# EAGLE design Thermostat (EAGLE 6.0)
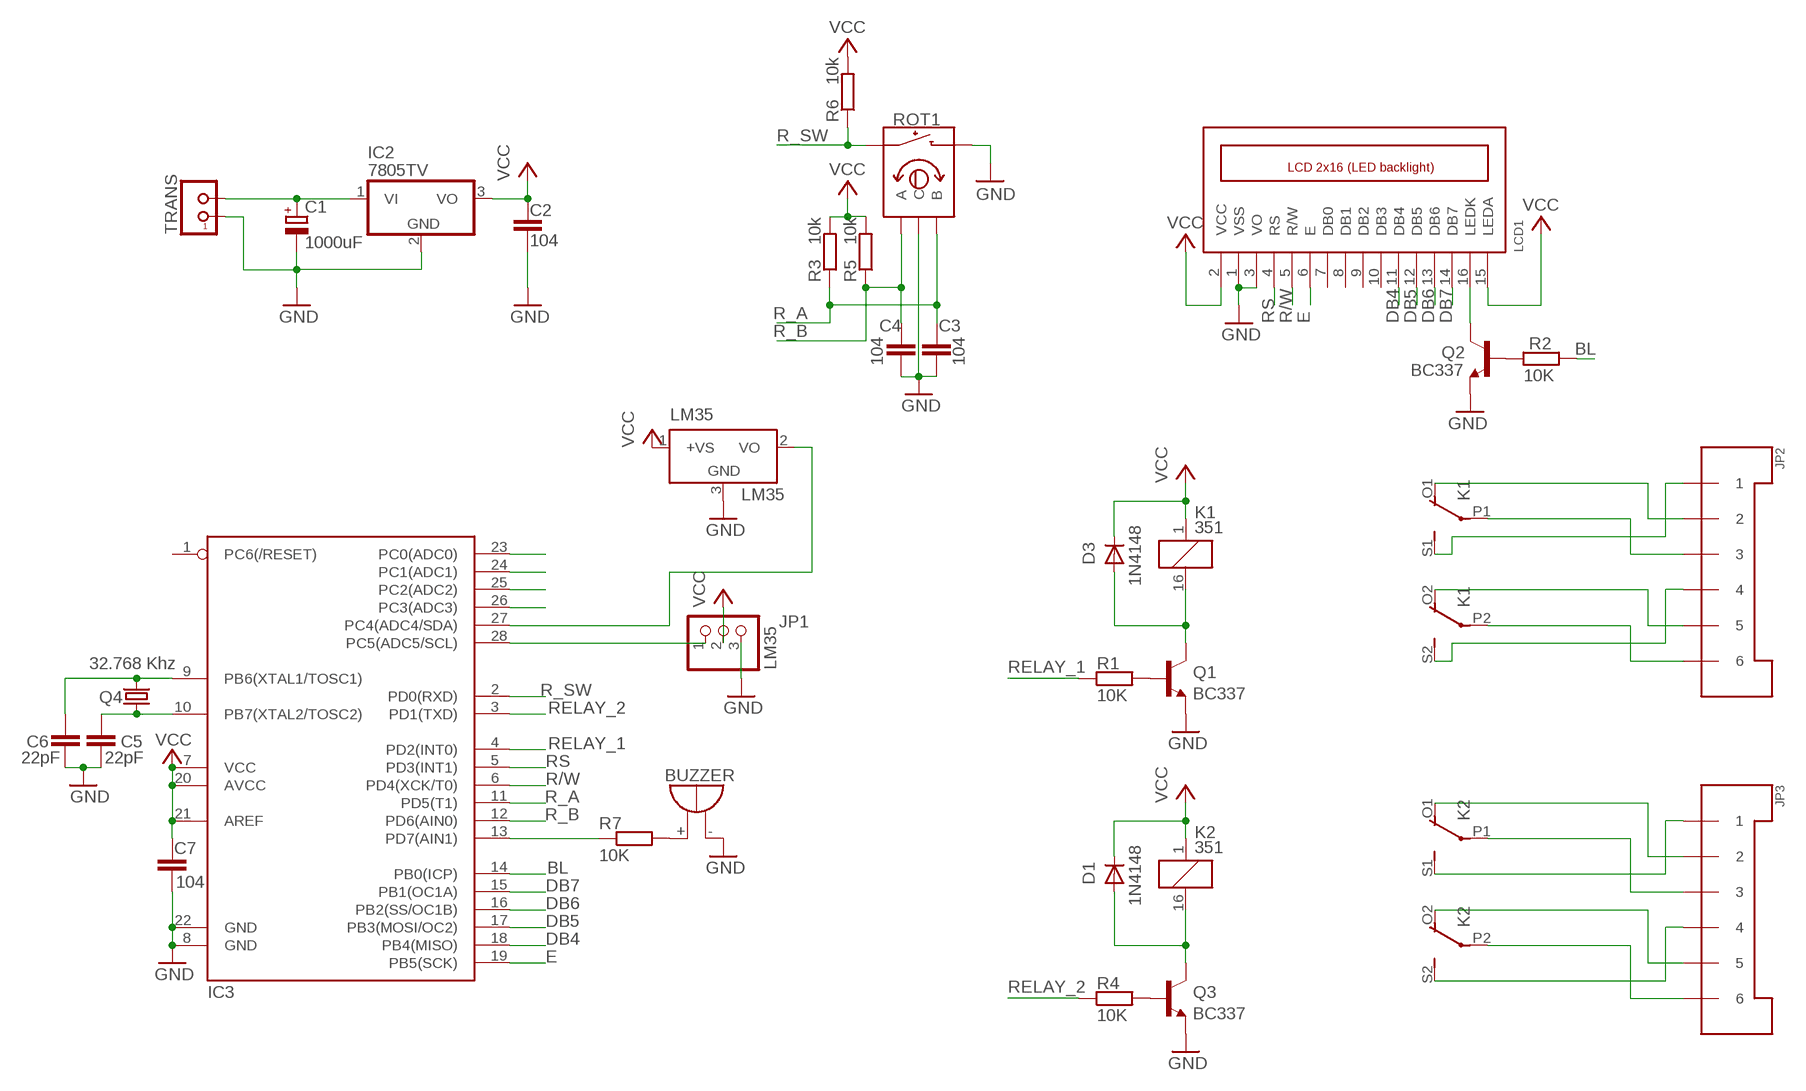
[diagram p0: schematic, sheet 1]

## Parts
BUZZER  F/HMB  [F/HMB]
C1  1000uF  C-POL13-SIDE  [C-TT2D13-SIDE]
C2  104  CC-22X6(FAKI)  [C-22X6(FAKI)]
C3  104  CC-22X6(FAKI)  [C-22X6(FAKI)]
C4  104  CC-22X6(FAKI)  [C-22X6(FAKI)]
C5  22pF  CC-22X6(FAKI)  [C-22X6(FAKI)]
C6  22pF  CC-22X6(FAKI)  [C-22X6(FAKI)]
C7  104  CC-22X6(FAKI)  [C-22X6(FAKI)]
D1  1N4148  1N4148DO35-10  [DO35-10]
D3  1N4148  1N4148DO35-10  [DO35-10]
IC2  7805TV  [TO220V]
IC3  ATMEGA-8-P  [DIL28-3]
JP1  LM35  PINHD-1X3  [1X03]
JP2  KLEMES_DELMAC_6  [KLEMES_DELMAC_6]
JP3  KLEMES_DELMAC_6  [KLEMES_DELMAC_6]
K1  351  [351]
K2  351  [351]
LCD1  LCD-HD44780PINHEAD  [HD44780-2X16-PINHEAD]
LM35  LM35  LM35T0-92  [TO-92]
Q1  BC337  BC548  [TO92-EBC]
Q2  BC337  BC548  [TO92-EBC]
Q3  BC337  BC548  [TO92-EBC]
Q4  32.768 Khz  CRYSTALTC38  [TC38]
R1  10K  R0207/10  [R0270/10]
R2  10K  R0207/10  [R0270/10]
R3  10k  R0207/10  [R0270/10]
R4  10K  R0207/10  [R0270/10]
R5  10k  R0207/10  [R0270/10]
R6  10k  R0207/10  [R0270/10]
R7  10K  R0207/10  [R0270/10]
ROT1  ROTARY/5-PIN  [5-PIN/RP]
TRANS  KLEMESX2  [KLEMESX2]

## Nets
BL: IC3.14(PB0(ICP)) R2.2
DB4: IC3.18(PB4(MISO)) LCD1.11(DB4)
DB5: IC3.17(PB3(MOSI/OC2)) LCD1.12(DB5)
DB6: IC3.16(PB2(SS/OC1B)) LCD1.13(DB6)
DB7: IC3.15(PB1(OC1A)) LCD1.14(DB7)
E: IC3.19(PB5(SCK)) LCD1.6(E)
GND: BUZZER.- C1.- C2.2 C3.2 C4.2 C5.2 C6.2 C7.2 IC2.2(GND) IC3.8(GND) IC3.22(GND) JP1.3 LCD1.1(VSS) LCD1.3(VO) LM35.3(GND1) Q1.E Q2.E Q3.E ROT1.C ROT1.SW2 TRANS.1
N$1: JP2.P$3 K1.P1(2:P)
N$2: JP3.P$2 K2.O1(2:O)
N$3: C1.+ IC2.1(VI) TRANS.2
N$4: D1.A K2.16 Q3.C
N$5: C5.1 IC3.10(PB7(XTAL2/TOSC2)) Q4.1
N$6: Q3.B R4.2
N$7: JP3.P$6 K2.P2(3:P)
N$8: BUZZER.+ R7.2
N$9: IC3.23(PC0(ADC0))
N$10: IC3.13(PD7(AIN1)) R7.1
N$12: IC3.28(PC5(ADC5/SCL)) JP1.1
N$13: LCD1.16(LEDK) Q2.C
N$16: C6.1 IC3.9(PB6(XTAL1/TOSC1)) Q4.2
N$17: Q2.B R2.1
N$22: D3.A K1.16 Q1.C
N$23: Q1.B R1.2
N$25: JP2.P$6 K1.P2(3:P)
N$26: JP2.P$1 K1.S1(2:S)
N$27: JP2.P$5 K1.O2(3:O)
N$28: JP2.P$4 K1.S2(3:S)
N$29: JP2.P$2 K1.O1(2:O)
N$31: JP3.P$1 K2.S1(2:S)
N$32: JP3.P$3 K2.P1(2:P)
N$33: JP3.P$5 K2.O2(3:O)
N$35: JP3.P$4 K2.S2(3:S)
N$37: IC3.27(PC4(ADC4/SDA)) LM35.2(VO)
N$38: IC3.26(PC3(ADC3))
N$39: IC3.25(PC2(ADC2))
N$40: IC3.24(PC1(ADC1))
R/W: IC3.6(PD4(XCK/T0)) LCD1.5(R/W)
R_A: C3.1 IC3.11(PD5(T1)) R3.1 ROT1.B
R_B: C4.1 IC3.12(PD6(AIN0)) R5.1 ROT1.A
R_SW: IC3.2(PD0(RXD)) R6.1 ROT1.SW1
RELAY_1: IC3.4(PD2(INT0)) R1.1
RELAY_2: IC3.3(PD1(TXD)) R4.1
RS: IC3.5(PD3(INT1)) LCD1.4(RS)
VCC: C2.1 C7.1 D1.C D3.C IC2.3(VO) IC3.7(VCC) IC3.20(AVCC) IC3.21(AREF) JP1.2 K1.1 K2.1 LCD1.2(VCC) LCD1.15(LEDA) LM35.1(+VS) R3.2 R5.2 R6.2
Unconnected: IC3.1(PC6(/RESET)) LCD1.7(DB0) LCD1.8(DB1) LCD1.9(DB2) LCD1.10(DB3)

## Library data of the parts
BUZZER = buzzer:F/HMB: BUZZER Source: Buerklin; OC_FARNELL: unknown; OC_NEWARK: unknown
C1 = candrian:C-POL
C2-C7 = candrian:C
D1 D3 = diode:1N4148: DIODE high speed (Philips)
IC2 = linear:78*: Positive VOLTAGE REGULATOR Source: http://cache.national.com/ds/LM/LM78L05.pdf http://www.fairchildsemi.com/ds/LM/LM7805.pdf
IC3 = candrian:ATMEGA-8-P
JP1 = pinhead:PINHD-1X3: PIN HEADER
JP2 JP3 = candrian:KLEMES_DELMAC_6
K1 K2 = relay:351: RELAY 2 x switch, Omron; OC_FARNELL: unknown; OC_NEWARK: unknown
LCD1 = candrian:LCD-HD44780
LM35 = candrian:LM35
Q1-Q3 = transistor-npn:BC548*: NPN Transistor
Q4 = candrian:CRYSTAL
R1-R7 = candrian:R
ROT1 = candrian:ROTARY/5-PIN: Rotary & Push button
TRANS = candrian:KLEMESX2

## Board
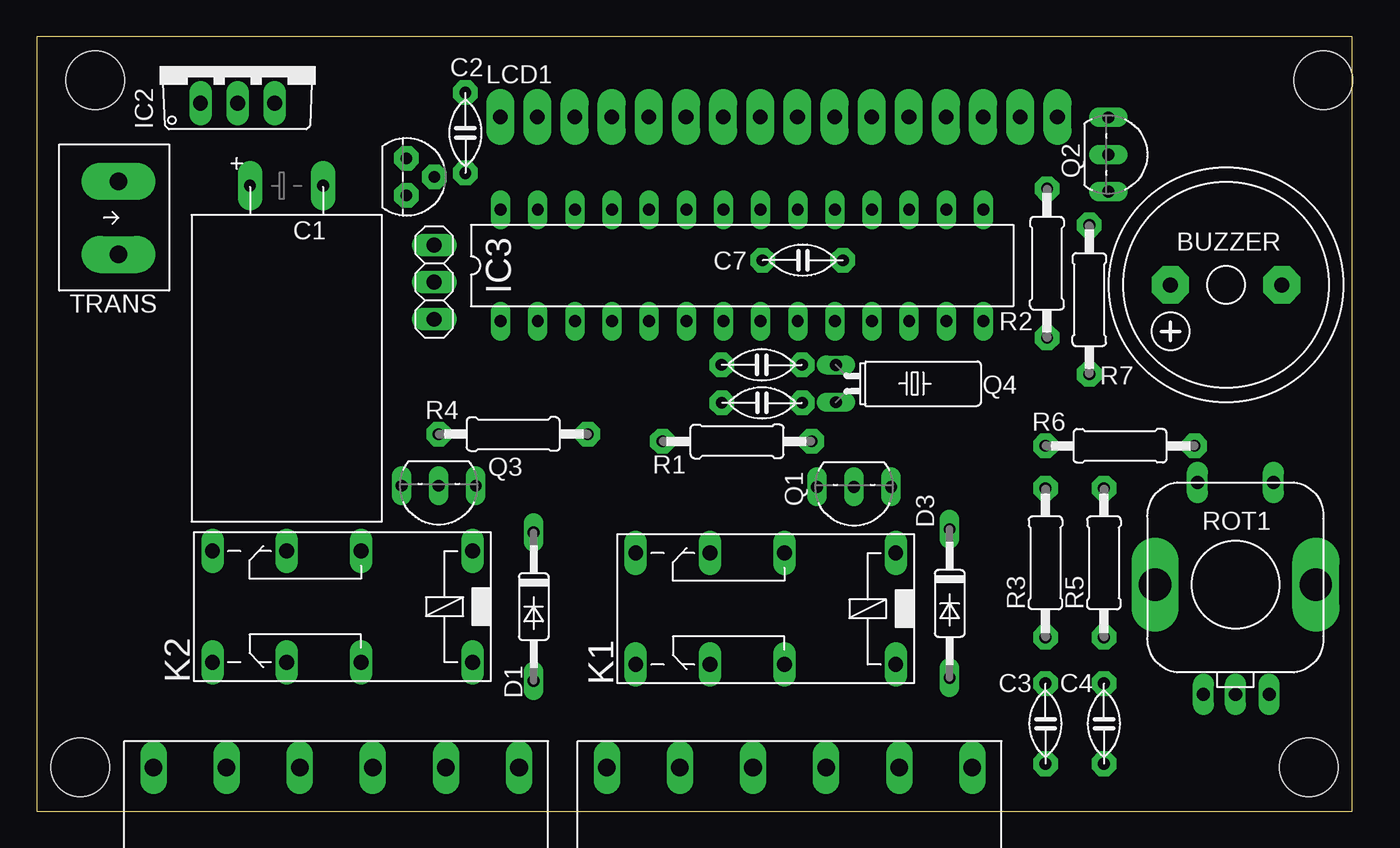
[diagram p1: board, top side]
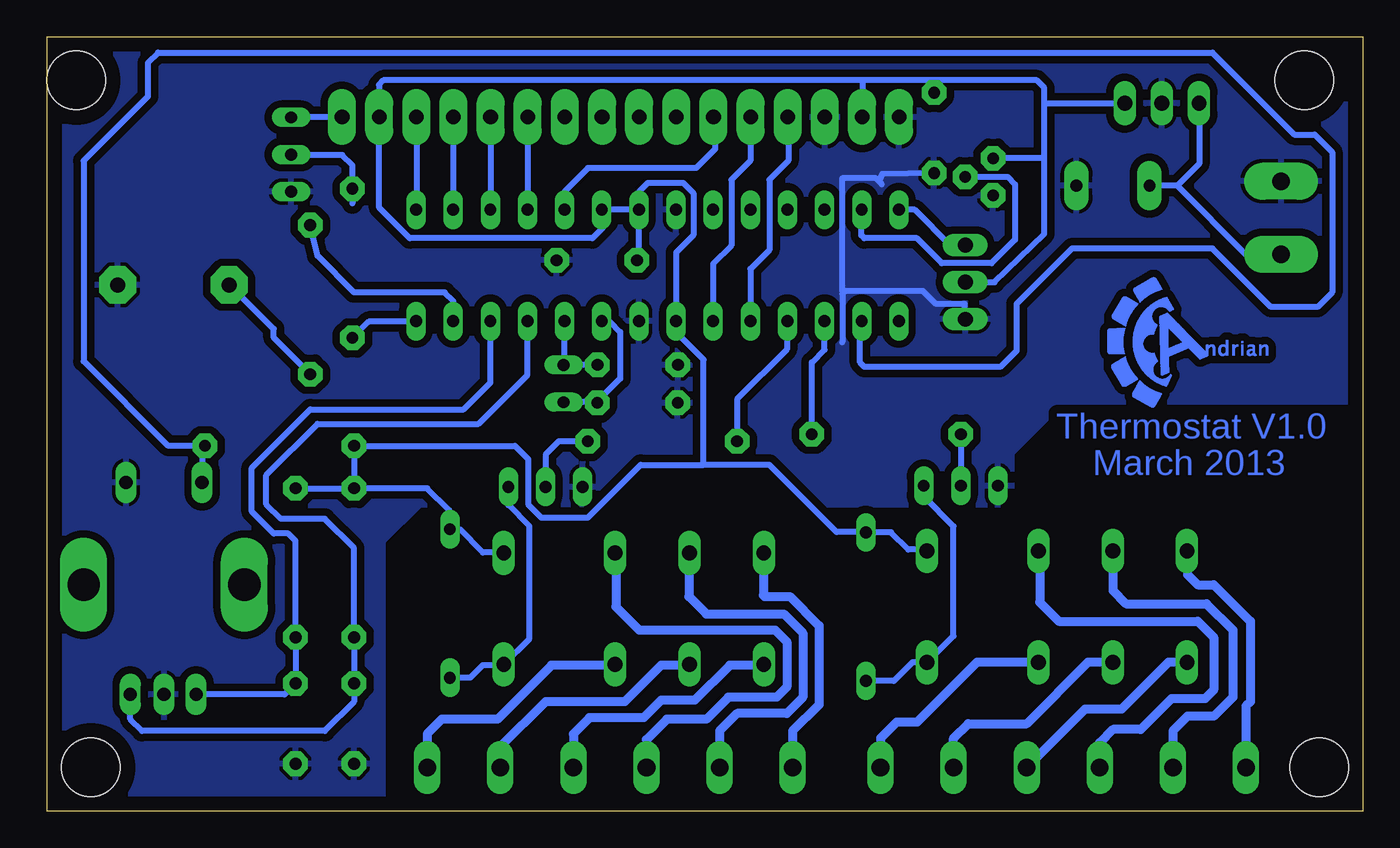
[diagram p2: board, bottom side, seen from below]

Size 90 x 53 mm. Coordinates in mm from the lower left corner, seen from the top.
Outline: 0,0 90,0 90,53 0,53 0,0
Copper layers (1*16): Top 0.035mm / dielectric 1.5mm / Bottom 0.035mm
Design rules: minimum track width 10mil, minimum drill 24mil, track to track 20mil, track to pad 20mil, pad to pad 20mil, via to via 8mil, smd to smd 8mil, copper to edge 40mil, drill to drill 8mil, minimum pad ring 10mil, minimum via ring 8mil, stop-mask expansion 4mil, vias tented up to drill 0mil, thermal gap 10mil
Holes 4 mm at 87,3 88,50 4,50 3,3

### Footprints (pad centres in the part's own frame; a part is rotated, then mirrored left to right if it is on the bottom)
F/HMB = drill 1.016 pad 2.54 octagon: + 3.81,0; - -3.81,0
C-TT2D13-SIDE = drill 0.8 pad 1.676 long: + -2,-2.5; - -2,2.5
C-22X6(FAKI) = drill 0.8 pad 1.676 octagon: 1 -2.75,0; 2 2.75,0
DO35-10 = drill 0.813 long: A 5.08,0; C -5.08,0
TO220V = drill 1.016 long: 1 -2.54,-2.54; 2 0,-2.54; 3 2.54,-2.54
DIL28-3 = drill 0.813 long: 1 -15.24,-3.81; 2 -12.7,-3.81; 3 -10.16,-3.81; 4 -7.62,-3.81; 5 -5.08,-3.81; 6 -2.54,-3.81; 7 0,-3.81; 8 2.54,-3.81; 9 5.08,-3.81; 10 7.62,-3.81; 11 10.16,-3.81; 12 12.7,-3.81; 13 15.24,-3.81; 14 17.78,-3.81; 15 17.78,3.81; 16 15.24,3.81; 17 12.7,3.81; 18 10.16,3.81; 19 7.62,3.81; 20 5.08,3.81; 21 2.54,3.81; 22 0,3.81; 23 -2.54,3.81; 24 -5.08,3.81; 25 -7.62,3.81; 26 -10.16,3.81; 27 -12.7,3.81; 28 -15.24,3.81
1X03 = drill 1.016 long: 1 -2.54,0; 2 0,0; 3 2.54,0
KLEMES_DELMAC_6 = drill 1.2 long: P$1 -10,0; P$2 -5,0; P$3 0,0; P$4 5,0; P$5 10,0; P$6 15,0
351 = drill 1.016 long: 1 -3.81,-3.81; 16 -3.81,3.81; O1 8.89,-3.81; O2 8.89,3.81; P1 3.81,-3.81; P2 3.81,3.81; S1 13.97,-3.81; S2 13.97,3.81
HD44780-2X16-PINHEAD = drill 1 pad 1.93 long: 1 -17.78,0; 2 -15.24,0; 3 -12.7,0; 4 -10.16,0; 5 -7.62,0; 6 -5.08,0; 7 -2.54,0; 8 0,0; 9 2.54,0; 10 5.08,0; 11 7.62,0; 12 10.16,0; 13 12.7,0; 14 15.24,0; 15 17.78,0; 16 20.32,0
TO-92 = drill 0.8 pad 1.676 octagon: 1 -1.27,0; 2 0,1.905; 3 1.27,0
TO92-EBC = drill 0.813 long: B 0,-1.27; C -2.54,-1.27; E 2.54,-1.27
TC38 = drill 0.8 pad 1.27 long: 1 -1.27,-3.81; 2 1.27,-3.81
R0270/10 = drill 0.8 pad 1.676 octagon: 1 -5.1,0; 2 5.1,0
5-PIN/RP = drill 0.9 pad 1.422 long: A -2.2,-8; B 2.3,-8; C 0,-8; SW1 -2.6,6.5; SW2 2.6,6.5 | drill 2.2 long: M1 -5.5,-0.5; M2 5.5,-0.5
KLEMESX2 = drill 1.2 pad 2.54 long: 1 -2.5,0; 2 2.5,0

### Placement (x,y rotation side)
BUZZER  81.36,36.01 180 top
C1  17.1,40.8 270 top
C2  29.33,46.41 270 top
C3  69,6 270 top
C4  73,6 270 top
C5  49.6,30.54 180 top
C6  49.62,27.94 180 top
C7  52.4,37.7 0 top
D1  34,14 270 top
D3  62.45,14.22 270 top
IC2  13.75,50.98 0 top
IC3  46.98,37.34 0 top
JP1  27.2,36.2 270 top
JP2  49,3 0 top
JP3  18,3 0 top
K1  54.95,13.86 180 top
K2  26,14 180 top
LCD1  49.5,47.5 0 top
LM35  25.3,43.4 270 top
Q1  55.91,20.93 180 top
Q2  74.57,44.93 270 top
Q3  27.5,21 180 top
Q4  58.48,29.26 270 top
R1  47.91,25.31 0 top
R2  69.11,37.49 270 top
R3  69,17 90 top
R4  32.6,25.8 180 top
R5  73,17 90 top
R6  74.1,25 180 top
R7  72,35 270 top
ROT1  82,16 0 top
TRANS  5.6,40.6 270 top
U$1  [CANDRIAN-LOGO/SMALL/BOTTOM]  13,32 0 top

### Tracks (layer width: path | path; a pad name or v marks a point on that pad's centre or on a via)
BL
  Bottom 0.406: IC3.14 64.79,33.5 68,33.5 R2.2
DB4
  Bottom 0.406: LCD1.11 57.14,47.48 IC3.18
DB5
  Bottom 0.406: LCD1.12 59.68,47.48 IC3.17
DB6
  Bottom 0.406: LCD1.13 62.22,47.48 IC3.16
DB7
  Bottom 0.406: IC3.15 64.7,41.21 64.7,47.4 64.74,47.44 LCD1.14
E
  Bottom 0.406: LCD1.6 44.3,47.38 44.3,45.3 45.6,44 53,44 54.6,42.4 IC3.19
GND
  Bottom 0.406: C2.2 32.89,43.6 33.1,43.1 | 33.1,43.1 32.9,42.9 | JP1.3 27.24,34.7 29.2,34.7 30.1,35.6 35.4,35.6 | 35.4,35.6 35.6,35.4 35.6,32.1 | 33.1,43.1 33.3,43.3 35.6,43.3 35.6,35.6 35.4,35.6
  pour Bottom: 0,53 90,53 90,0 67,0 67,18.5 64.5,21 24,21 24,24.5 21.5,27 2,27 0,29
N$1
  Bottom 0.61: K1.P1 51.1,17.63 51.1,14 49.5,12.4 40.2,12.4 39.4,11.6 39.4,8.5 40.1,7.8 43.4,7.8 44.9,6.3 47.6,6.3 49,4.9 JP2.P$3
N$2
  Bottom 0.61: K2.O1 17.1,15.1 16.2,14.2 10.7,14.2 8.9,12.4 8.9,7.8 10.2,6.5 12,6.5 13,5.5 JP3.P$2
N$3
  Bottom 0.406: 14.7,42.8 C1.+ 12.7,42.8 | TRANS.2 8,38.1 12.7,42.8 | IC2.1 11.2,44.3 12.7,42.8
N$4
  Bottom 0.406: D1.A 32.08,8.92 30.8,10.2 K2.16 28,12 28,19.5 30.04,21.54 Q3.C
N$5
  Bottom 0.406: C5.1 Q4.1 54.6,30.6 IC3.10
N$6
  Bottom 0.406: R4.2 Q3.B 27.5,22
N$7
  Bottom 0.61: K2.P2 26.4,10.2 30.5,6.1 31.9,6.1 33,5 JP3.P$6
N$8
  Bottom 0.406: R7.2 74.5,32.4 74.5,33 77.5,36 BUZZER.+
N$10
  Bottom 0.406: IC3.13 62.2,33.55 62.2,34.9 62.8,35.5 69,35.5 71.5,38 R7.1
N$12
  Bottom 0.406: JP1.1 26.74,38.7 28.2,38.7 30.65,41.15 IC3.28
N$13
  Bottom 0.406: LCD1.16 69.85,47.47 Q2.C
N$16
  Bottom 0.406: IC3.9 52.03,33.5 51.5,33.5 50.8,32.8 50.8,29.6 52.37,28.03 C6.1 52.42,27.99 Q4.2
N$17
  Bottom 0.406: R2.1 69.1,41.6 69.1,44.2 69.8,44.9 74.3,44.9 Q2.B
N$22
  Bottom 0.406: D3.A 61.06,9.14 60.2,10 58.81,10 K1.16 57,11.81 57,19.5 58.45,20.95 Q1.C
N$23
  Bottom 0.406: R1.2 55,25.3 55.9,24.4 Q1.B
N$25
  Bottom 0.61: K1.P2 51.19,10 55.5,10 59.2,6.3 63,6.3 64,5.3 JP2.P$6
N$26
  Bottom 0.61: K1.S1 41,17.65 41,14.8 40.9,14.7 39.2,14.7 37.2,12.7 37.2,7.3 39,5.5 JP2.P$1
N$27
  Bottom 0.61: K1.O2 46.11,10 48,10 50.5,7.5 55.9,7.5 59,4.4 JP2.P$5
N$28
  Bottom 0.61: K1.S2 41.03,10 43.3,10 45.7,7.6 48,7.6 49.2,6.4 52.9,6.4 54,5.3 JP2.P$4
N$29
  Bottom 0.61: K1.O1 46.1,17.63 46.1,14.7 44.9,13.5 39.6,13.5 38.3,12.2 38.3,7.8 39.4,6.7 42.8,6.7 44,5.5 JP2.P$2
N$31
  Bottom 0.61: K2.S1 12,17.78 12,16.2 11.3,15.5 10.2,15.5 7.7,13 7.7,7.5 8,7.2 JP3.P$1
N$32
  Bottom 0.61: K2.P1 22.1,17.72 22.1,14.3 20.8,13 11.3,13 10.2,11.9 10.2,8.3 10.8,7.7 13.1,7.7 15.2,5.6 17.1,5.6 18,4.7 JP3.P$3
N$33
  Bottom 0.61: JP3.P$5 28,5 27,6 23,6 18.8,10.2 K2.O2
N$35
  Bottom 0.61: JP3.P$4 19,7 16.5,7 13.3,10.2 K2.S2
N$37
  Bottom 0.406: LM35.2 24.3,43.4 23.8,42.9 23.8,39.1 25.4,37.5 28.8,37.5 30.5,39.2 34.1,39.2 34.3,39.4 34.3,41.2 34.28,41.18 IC3.27
R/W
  Bottom 0.406: LCD1.5 41.9,47.48 41.9,44.5 43.2,43.2 43.2,38.7 44.44,37.46 IC3.6
R_A
  Bottom 0.406: ROT1.B 84.3,6.3 83.5,5.5 71,5.5 69,7.5 C3.1 R3.1 69,18 71,20 74,20 75,21 75,23 71.5,26.5 60.5,26.5 57.14,29.86 IC3.11
R_B
  Bottom 0.406: ROT1.A 73.75,8 C4.1 R5.1 73,18.5 73.5,19 74.5,19 76,20.5 76,23.5 72,27.5 61.5,27.5 59.68,29.32 IC3.12
R_SW
  Bottom 0.406: ROT1.SW1 79.4,24.7 R6.1 81.7,25 87.5,30.8 87.5,44.5 83.1,48.9 83.1,51.2 82.4,51.9 10.3,51.9 4.7,46.3 3.3,46.3 2.1,45.1 2.1,35.5 3.1,34.5 6.3,34.5 10.3,38.5 19.9,38.5 23.7,34.7 23.7,31.5 24.8,30.4 34.1,30.4 34.4,30.7 34.4,33.41 IC3.2
RELAY_1
  Bottom 0.406: IC3.4 39.4,33.49 39.4,31.6 42.81,28.19 R1.1
RELAY_2
  Bottom 0.406: R4.1 37.7,30.7 36.82,31.58 IC3.3
RS
  Bottom 0.406: LCD1.4 39.3,47.46 39.3,44.5 40.6,43.2 40.6,38.4 41.9,37.1 IC3.5
VCC
  Bottom 0.406: K2.1 29.9,17.9 31.1,17.9 32.28,19.08 D1.C 34.02,19.1 36,19.1 40.6,23.7 45.1,23.7 | K1.1 58.79,17.7 60.2,17.7 61.8,19.3 D3.C 62.5,19.35 62.5,20.6 64,22.1 R3.2 | R5.2 R3.2 | R3.2 R6.2 58,25 57.1,24.1 57.1,21 56.2,20.1 53,20.1 49.4,23.7 45.1,23.7 | R3.2 69,22 | IC3.21 IC3.20 52,41.09 52,39.9 52.7,39.2 65.2,39.2 67.28,41.28 LCD1.15 67.28,47.68 67.3,47.7 67.3,49.7 67,50 34.2,50 | LCD1.2 34.2,47.56 34.2,50 | IC3.21 49.5,41.17 49.5,42.4 48.9,43 46.5,43 45.8,42.3 45.8,39.4 46.98,38.22 IC3.7 46.98,32.78 45.1,30.9 45.1,23.7 | 29.4,50 22.3,50 21.8,49.5 21.8,48.4 | 29.4,50 34.2,50 | C2.1 29.4,48.73 29.4,50 | JP1.2 25.2,36.2 21.8,39.5 21.8,44.7 | 21.8,44.7 21.8,48.4 | C7.1 49.52,37.7 IC3.21 | LM35.1 25.37,44.7 21.8,44.7 | IC2.3 16.33,48.4 21.8,48.4

### Text on the board
Bottom: Thermostat V1.0 | March 2013